# EAGLE schematic ArduinoSmarticle (EAGLE 7.2.0)
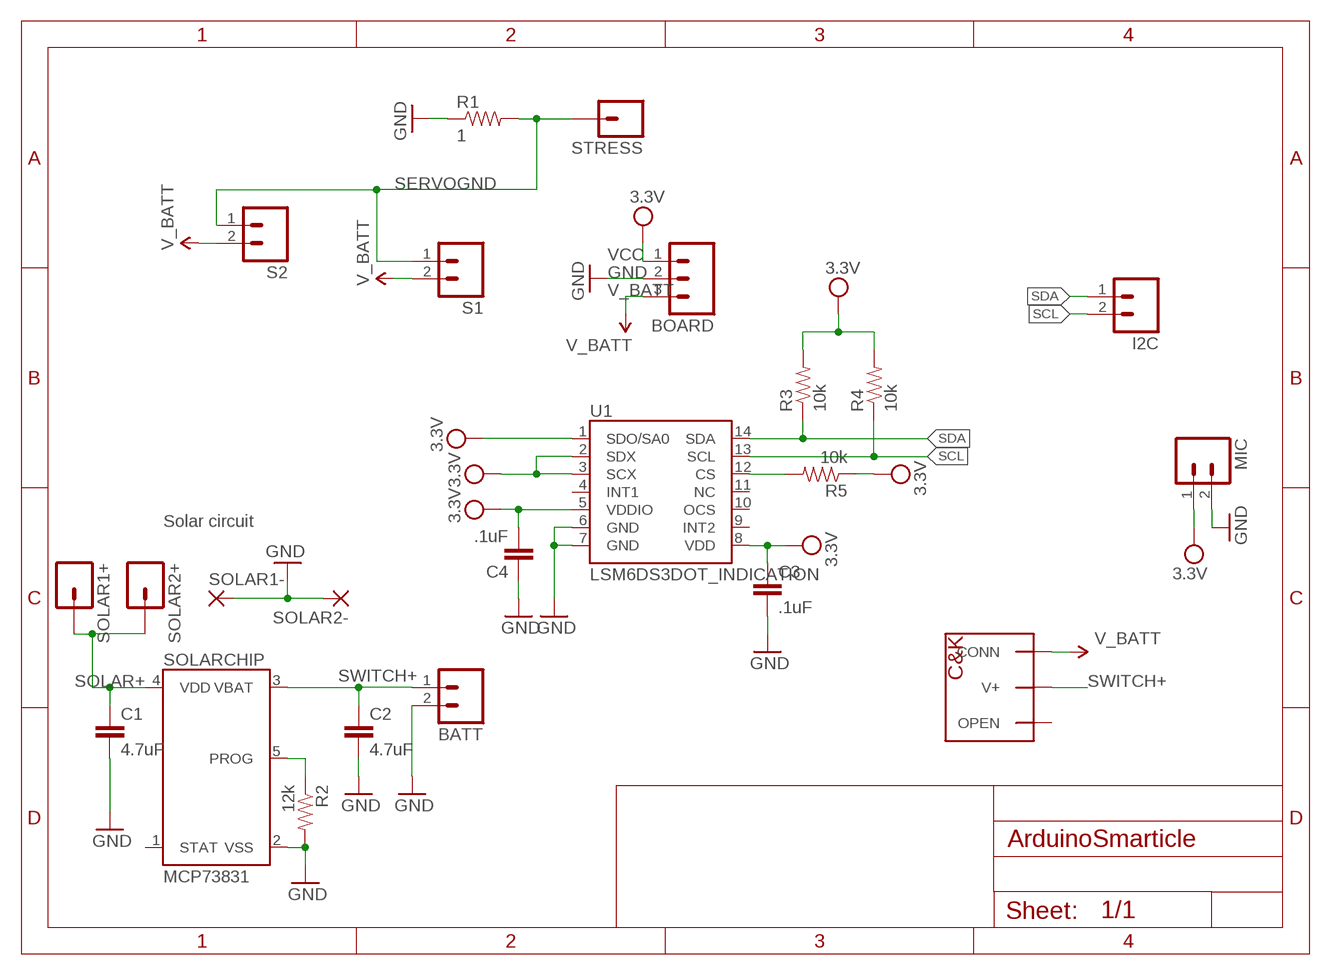
[diagram p0: schematic, sheet 1]

## Parts
BATT  M02PTH  [1X02]
BOARD  M03PTH  [1X03]
C1  4.7uF  4.7UF-6.3V-10%(0603)0603  [0603-CAP]
C2  4.7uF  4.7UF-6.3V-10%(0603)0603  [0603-CAP]
C3  .1uF  4.7UF-6.3V-10%(0603)0603  [0603-CAP]
C4  .1uF  4.7UF-6.3V-10%(0603)0603  [0603-CAP]
I2C  M02PTH  [1X02]
MIC  M02PTH  [1X02]
R1  1  2.0KOHM1/10W5%(0603)  [0603-RES]
R2  12k  10.5KOHM1/10W1%(0603)  [0603]
R3  10k  4.7KOHM-1/10W-1%(0603)  [0603-RES]
R4  10k  4.7KOHM-1/10W-1%(0603)  [0603-RES]
R5  10k  4.7KOHM-1/10W-1%(0603)  [0603-RES]
S1  M02PTH  [1X02]
S2  M02PTH  [1X02]
SOLAR1+  M01PTH  [1X01]
SOLAR1-  1,6/0,9  [1,6/0,9]
SOLAR2+  M01PTH  [1X01]
SOLAR2-  1,6/0,9  [1,6/0,9]
SOLARCHIP  MCP73831  [SOT23-5]
STRESS  M01PTH  [1X01]
U1  LSM6DS3DOT_INDICATION  [LGA14L_DOT_INDICATOR]
U$1  WILL-BLACKSLIDESWITCH  [WILL-BLACKSLIDESWITCH]

## Nets
GND: BATT.2 BOARD.2 C1.2 C2.2 C3.2 C4.1 MIC.2 R1.1 R2.2 SOLAR1-.1(P) SOLAR2-.1(P) SOLARCHIP.2(VSS) U1.6(GND) U1.7(GND)
N$2: R5.2 U1.12(CS)
N$5: R2.1 SOLARCHIP.5(PROG)
SCL: I2C.2 R4.1 U1.13(SCL)
SDA: I2C.1 R3.1 U1.14(SDA)
SERVOGND: R1.2 S1.1 S2.1 STRESS.1
SOLAR+: C1.1 SOLAR1+.1 SOLAR2+.1 SOLARCHIP.4(VDD)
SWITCH+: BATT.1 C2.1 SOLARCHIP.3(VBAT) U$1.V+
V_BATT: BOARD.3 S1.2 S2.2 U$1.CONN
VCC: BOARD.1 C3.1 C4.2 MIC.1 R3.2 R4.2 R5.1 U1.1(SDO/SA0) U1.2(SDX) U1.3(SCX) U1.5(VDDIO) U1.8(VDD) ; supply symbol labelled 3.3V
Unconnected: SOLARCHIP.1(STAT) U1.4(INT1) U1.9(INT2) U1.10(OCS) U1.11(NC) U$1.NC(OPEN)

## Notes on the sheet
- Solar circuit

## Library data of the parts
BATT I2C MIC S1 S2 = SparkFun-Connectors:M02: Standard 2-pin 0.1" header. Use with - straight break away headers ( PRT-00116) - right angle break away headers (PRT-00553) - swiss pins (PRT-00743) - machine pins (PRT-00117) - female headers (PRT-00115) Molex polarized connector foot print use with: PRT-08233 with associated crimp pins and housings. 2.54_SCREWTERM for use with PRT-10571. 3.5mm Screw Terminal footprints for PRT-08084 5mm Screw Terminal footprints for use with PRT-08432
BOARD = SparkFun-Connectors:M03: Header 3 Standard 3-pin 0.1" header. Use with straight break away headers (SKU : PRT-00116), right angle break away headers (PRT-00553), swiss pins (PRT-00743), machine pins (PRT-00117), and female headers (PRT-00115). Molex polarized connector foot print use with SKU : PRT-08232 with associated crimp pins and housings.
C1 C2 = SparkFun-Capacitors:4.7UF-6.3V-10%(0603): CAP-08280; PROD_ID: CAP-08280
C3 C4 = SparkFun-Capacitors:4.7UF-6.3V-10%(0603): CAP-08280; PROD_ID: CAP-08280; VALUE: 4.7uF
R1 = SparkFun-Resistors:2.0KOHM1/10W5%(0603): RES-08296; PROD_ID: RES-08296; VALUE: 2.0k
R2 = SparkFun-Resistors:10.5KOHM1/10W1%(0603): RES-09570; PROD_ID: RES-09570; VALUE: 10.5k
R3-R5 = SparkFun-Resistors:4.7KOHM-1/10W-1%(0603): RES-07857; PROD_ID: RES-07857; VALUE: 4.7K
SOLAR1+ SOLAR2+ STRESS = SparkFun-Connectors:M01: Header 1 Standard 1-pin 0.1" header. Use with straight break away headers (SKU : PRT-00116), right angle break away headers (PRT-00553), swiss pins (PRT-00743), machine pins (PRT-00117), and female headers (PRT-00115). SMTSO-256-ET is a "flush mount" nut for a 4-40 screw. The older package used to be too tight, and did not allow it to sit properly thru the drill hit. The latest (0.165DIA) fits nice and snug.
SOLAR1- SOLAR2- = wirepad:1,6/0,9: THROUGH-HOLE PAD
SOLARCHIP = GeekAmmo:MCP73831: MCP73831 Miniature Single-Cell, Fully Integrated Li-Ion, Li-Polymer Charge Management Controllers The MCP73831/2 devices are highly advanced linear charge management controllers for use in spacelimited, cost-sensitive applications. http://ww1.microchip.com/downloads/en/DeviceDoc/20001984F.pdf
U1 = LSM6DS3:LSM6DS3; PROD_ID: IC-12969
U$1 = Will-Switch:WILL-BLACKSLIDESWITCH